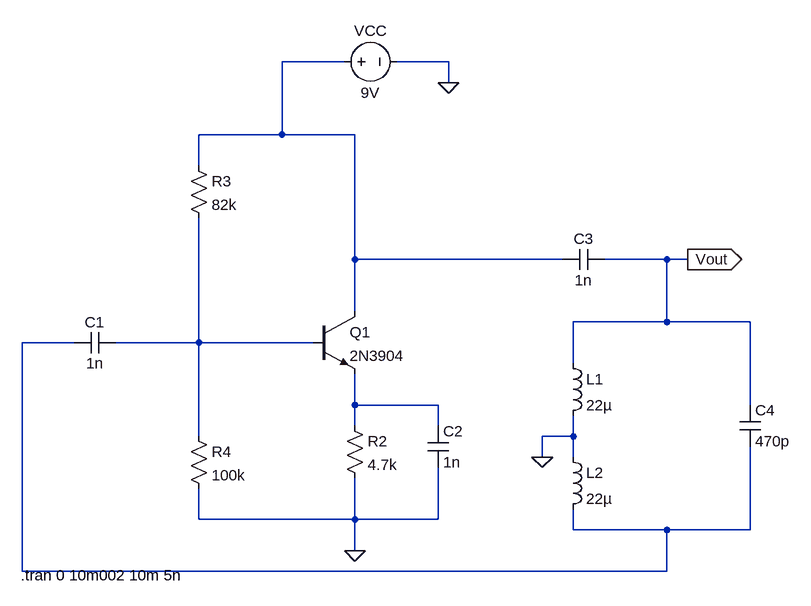
[diagram p0: schematic b20027_hartely.asc]
b20027_hartely.asc, the LTspice schematic file:
Version 4
SHEET 1 908 680
WIRE 192 -192 96 -192
WIRE 352 -192 272 -192
WIRE 352 -160 352 -192
WIRE 96 -80 96 -192
WIRE 96 -80 -32 -80
WIRE 208 -80 96 -80
WIRE -32 -32 -32 -80
WIRE 208 112 208 -80
WIRE 528 112 208 112
WIRE 688 112 592 112
WIRE 720 112 688 112
WIRE 208 192 208 112
WIRE 688 208 688 112
WIRE 688 208 544 208
WIRE 816 208 688 208
WIRE -224 240 -304 240
WIRE -32 240 -32 48
WIRE -32 240 -160 240
WIRE 144 240 -32 240
WIRE 544 272 544 208
WIRE 208 336 208 288
WIRE 336 336 208 336
WIRE 816 336 816 208
WIRE 208 368 208 336
WIRE 336 368 336 336
WIRE -32 384 -32 240
WIRE 544 384 544 352
WIRE 544 384 496 384
WIRE 496 416 496 384
WIRE 544 416 544 384
WIRE -32 512 -32 464
WIRE 208 512 208 448
WIRE 208 512 -32 512
WIRE 336 512 336 432
WIRE 336 512 208 512
WIRE 544 528 544 496
WIRE 688 528 544 528
WIRE 816 528 816 400
WIRE 816 528 688 528
WIRE 208 560 208 512
WIRE -304 592 -304 240
WIRE 688 592 688 528
WIRE 688 592 -304 592
FLAG 208 560 0
FLAG 352 -160 0
FLAG 496 416 0
FLAG 720 112 Vout
IOPIN 720 112 Out
SYMBOL npn 144 192 R0
SYMATTR InstName Q1
SYMATTR Value 2N3904
SYMBOL res 192 352 R0
SYMATTR InstName R2
SYMATTR Value 4.7k
SYMBOL cap -160 224 R90
WINDOW 0 0 32 VBottom 2
WINDOW 3 32 32 VTop 2
SYMATTR InstName C1
SYMATTR Value 1n
SYMBOL res -48 -48 R0
SYMATTR InstName R3
SYMATTR Value 82k
SYMBOL res -48 368 R0
SYMATTR InstName R4
SYMATTR Value 100k
SYMBOL cap 320 368 R0
SYMATTR InstName C2
SYMATTR Value 1n
SYMBOL voltage 176 -192 R270
WINDOW 0 32 56 VTop 2
WINDOW 3 -32 56 VBottom 2
WINDOW 123 0 0 Left 0
WINDOW 39 0 0 Left 0
SYMATTR InstName VCC
SYMATTR Value 9V
SYMBOL cap 592 96 R90
WINDOW 0 0 32 VBottom 2
WINDOW 3 32 32 VTop 2
SYMATTR InstName C3
SYMATTR Value 1n
SYMBOL ind 528 256 R0
SYMATTR InstName L1
SYMATTR Value 22µ
SYMBOL ind 528 400 R0
SYMATTR InstName L2
SYMATTR Value 22µ
SYMBOL cap 800 336 R0
SYMATTR InstName C4
SYMATTR Value 470p
TEXT -306 598 Left 2 !.tran 0 10m002 10m 5n

The netlist it stands for:
* b20027_hartely.asc
Q1 N001 N003 N004 0 2N3904
R2 N004 0 4.7k
C1 N003 N002 1n
R3 N001 N003 82k
R4 N003 0 100k
C2 N004 0 1n
VCC N001 0 9V
C3 Vout N001 1n
L1 Vout 0 22µ
L2 0 N002 22µ
C4 Vout N002 470p
.model NPN NPN
.model PNP PNP
.lib standard.bjt
.tran 0 10m002 10m 5n
.backanno
.end